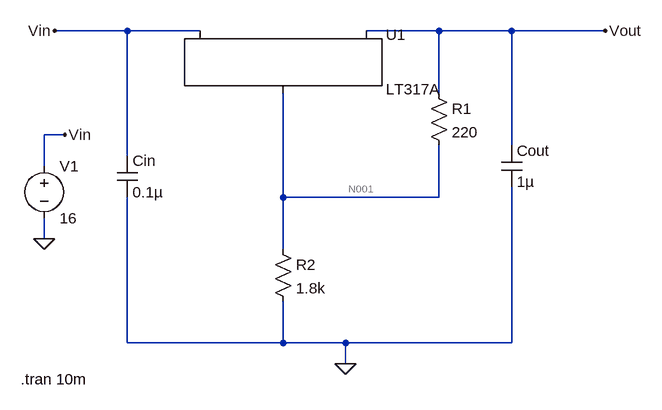
[diagram p0: schematic Regulador_tension.asc]
Regulador_tension.asc, the LTspice schematic file:
Version 4
SHEET 1 880 728
WIRE -32 176 -144 176
WIRE 80 176 -32 176
WIRE 448 176 336 176
WIRE 560 176 448 176
WIRE 704 176 560 176
WIRE 448 272 448 176
WIRE -128 336 -160 336
WIRE 560 352 560 176
WIRE -32 368 -32 176
WIRE -160 384 -160 336
WIRE 208 432 208 272
WIRE 448 432 448 352
WIRE 448 432 208 432
WIRE -160 496 -160 464
WIRE 208 512 208 432
WIRE -32 656 -32 432
WIRE 208 656 208 592
WIRE 208 656 -32 656
WIRE 304 656 208 656
WIRE 560 656 560 416
WIRE 560 656 304 656
WIRE 304 688 304 656
FLAG -144 176 Vin
FLAG 704 176 Vout
FLAG 304 688 0
FLAG -160 496 0
FLAG -128 336 Vin
SYMBOL PowerProducts\\LT317A 208 176 R0
SYMATTR InstName U1
SYMBOL res 192 496 R0
SYMATTR InstName R2
SYMATTR Value 1.8k
SYMBOL res 432 256 R0
SYMATTR InstName R1
SYMATTR Value 220
SYMBOL cap 544 352 R0
SYMATTR InstName Cout
SYMATTR Value 1µ
SYMBOL cap -48 368 R0
SYMATTR InstName Cin
SYMATTR Value 0.1µ
SYMBOL voltage -160 368 R0
WINDOW 123 0 0 Left 0
WINDOW 39 0 0 Left 0
SYMATTR InstName V1
SYMATTR Value 16
TEXT -196 712 Left 2 !.tran 10m

The netlist it stands for:
* Regulador_tension.asc
XU1 N001 Vout Vin LT317A
R2 N001 0 1.8k
R1 Vout N001 220
Cout Vout 0 1µ
Cin Vin 0 0.1µ
V1 Vin 0 16
.tran 10m
.lib LTC.lib
.backanno
.end

* Results of the author's LTspice run, read from the files saved beside the schematic
* Operating Point, zero values left out:
*   V(vin) = 16 V
*   V(vout) = 11.54 V
*   V(n001) = 10.29 V
*   I(R1) = 5.67 mA
*   I(R2) = 5.718 mA
*   I(V1) = -5.718 mA
*   Ix(u1:1) = -47.52 µA
*   Ix(u1:2) = -5.67 mA
*   Ix(u1:3) = 5.718 mA